# EAGLE schematic humanoid-11 (EAGLE 7.2.0)

## Sheet 1 of 10
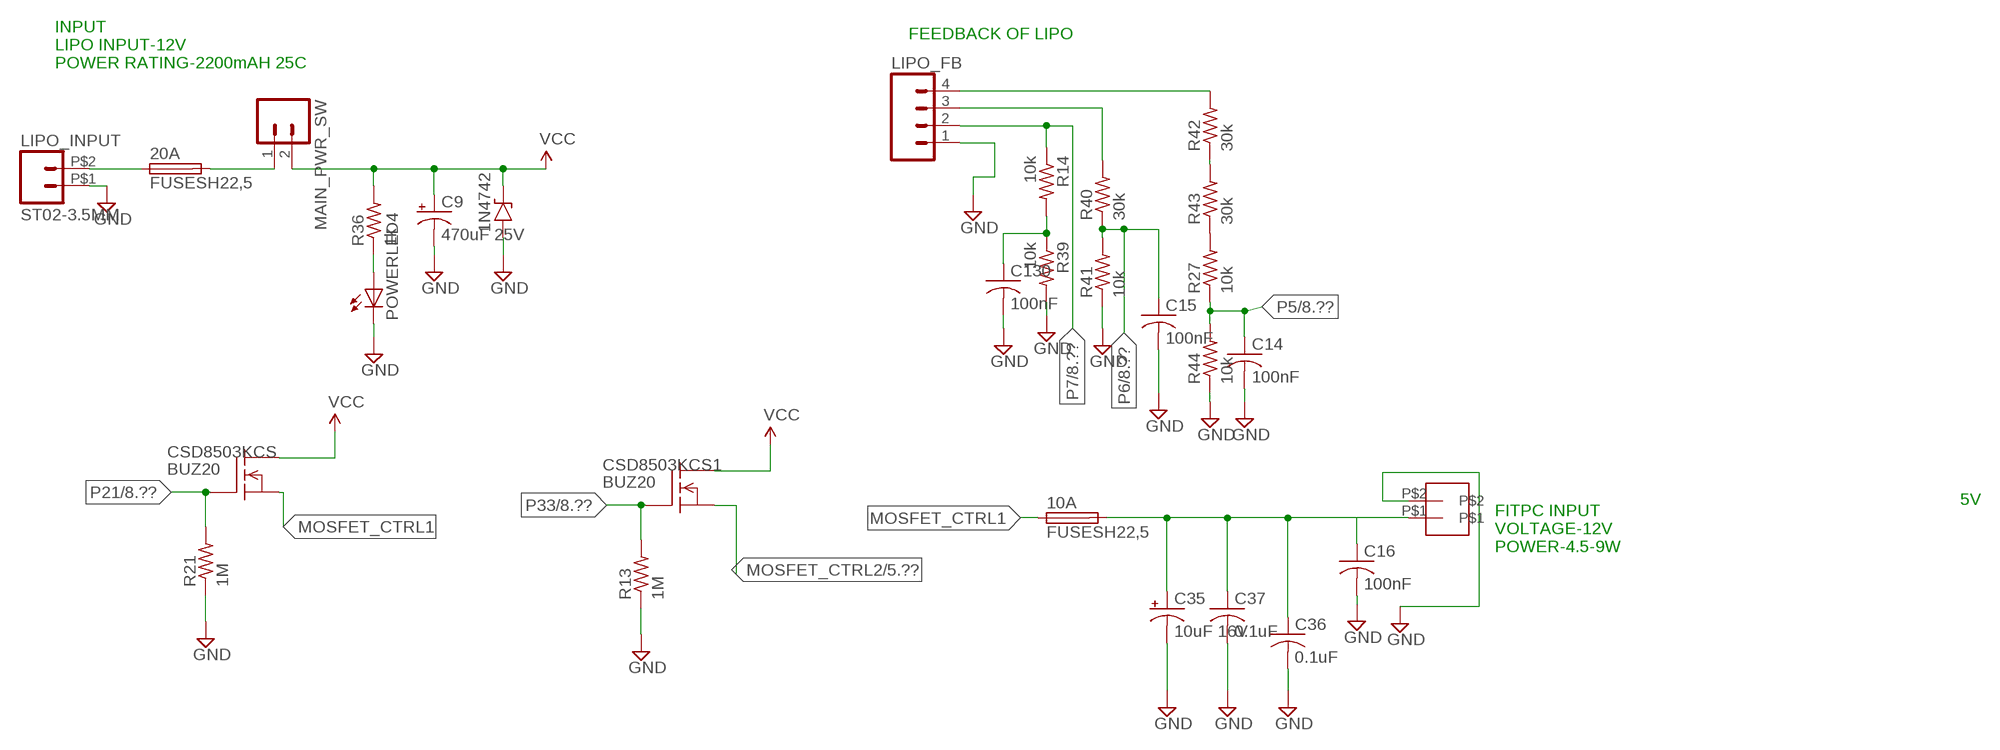
[diagram p0: schematic, sheet 1]

### Parts
1N4742  1N47XX3  [DO41-3]
10A  FUSESH22,5  [SH22,5]
20A  FUSESH22,5  [SH22,5]
C9  470uF 25V  CPOL-USG  [PANASONIC_G]
C14  100nF  C-USC1206  [C1206]
C15  100nF  C-USC1206  [C1206]
C16  100nF  C-USC1206  [C1206]
C35  10uF 16V  CPOL-USB  [PANASONIC_B]
C36  0.1uF  C-USC0805  [C0805]
C37  0.1uF  C-USC0805  [C0805]
C130  100nF  C-USC1206  [C1206]
CSD8503KCS  BUZ20  [TO220]
CSD8503KCS1  BUZ20  [TO220]
FITPC  2PINRIGHT  [2PINRIGHT]
LIPO_FB  M04PTH  [1X04]
LIPO_INPUT  ST02-3.5MM  [ED350V-02P]
MAIN_PWR_SW  M02PTH  [1X02]
POWERLED4  LEDCHIPLED_1206  [CHIPLED_1206]
R13  1M  R-US_R0805  [R0805]
R14  10k  R-US_R0805  [R0805]
R21  1M  R-US_R0805  [R0805]
R27  10k  R-US_R0805  [R0805]
R36  1k  R-US_R0805  [R0805]
R39  10k  R-US_R0805  [R0805]
R40  30k  R-US_R0805  [R0805]
R41  10k  R-US_R0805  [R0805]
R42  30k  R-US_R0805  [R0805]
R43  30k  R-US_R0805  [R0805]
R44  10k  R-US_R0805  [R0805]

### Nets
GND: 1N4742.A C9.- C14.2 C15.2 C16.2 C35.- C36.2 C37.2 C130.2 FITPC.P$2 LIPO_FB.1 LIPO_INPUT.P$1 POWERLED4.C R13.1 R21.1 R39.2 R41.1 R44.1 ; also sheet 2,3,5,6,7,8,9,10
LIPO_FB4: LIPO_FB.4 R42.2
MOSFET_CTRL1: 10A.1 CSD8503KCS.3(S)
MOSFET_CTRL2: CSD8503KCS1.3(S) ; also sheet 5
N$1: C130.1 R14.2 R39.1
N$9: 20A.2 MAIN_PWR_SW.1
N$14: 20A.1 LIPO_INPUT.P$2
N$19: R27.2 R43.1
N$337: R42.1 R43.2
N$338: LIPO_FB.3 R40.2
N$378: 10A.2 C16.1 C35.+ C36.1 C37.1 FITPC.P$1
N$381: POWERLED4.A R36.1
P5: C14.1 R27.1 R44.2 ; also sheet 8
P6: C15.1 R40.1 R41.2 ; also sheet 8
P7: LIPO_FB.2 R14.1 ; also sheet 8
P21: CSD8503KCS.1(G) R21.2 ; also sheet 8
P33: CSD8503KCS1.1(G) R13.2 ; also sheet 8
VCC: 1N4742.C C9.+ CSD8503KCS1.2(D) CSD8503KCS.2(D) MAIN_PWR_SW.2 R36.2 ; also sheet 3

### Notes on the sheet
- FEEDBACK OF LIPO
- INPUT
  LIPO INPUT-12V
  POWER RATING-2200mAH 25C
- 5V
- FITPC INPUT
  VOLTAGE-12V
  POWER-4.5-9W

## Sheet 2 of 10
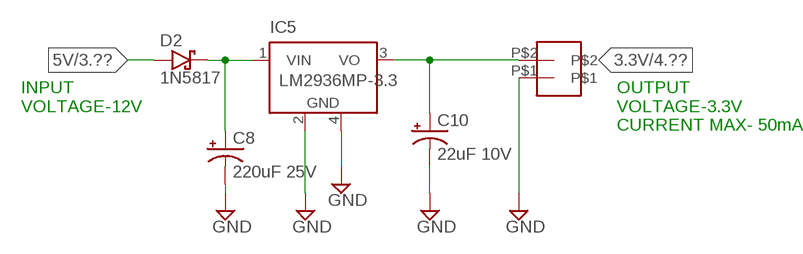
[diagram p1: schematic, sheet 2]

### Parts
3.3V1  2PINRIGHT  [2PINRIGHT]
C8  220uF 25V  CPOL-USG  [PANASONIC_G]
C10  22uF 10V  CPOL-USB  [PANASONIC_B]
D2  1N5817  [DO41-3]
IC5  LM2936MP-3.3  [SOT223]

### Nets
3.3V: 3.3V1.P$2 C10.+ IC5.3(VO) ; also sheet 4,8,9,10
5V: D2.A ; also sheet 3,4,6,7,8,9
GND: 3.3V1.P$1 C8.- C10.- IC5.2(GND) IC5.4(GND) ; also sheet 1,3,5,6,7,8,9,10
N$3: C8.+ D2.C IC5.1(VIN)

### Notes on the sheet
- INPUT
  VOLTAGE-12V
- OUTPUT
  VOLTAGE-3.3V
  CURRENT MAX- 50mA

## Sheet 3 of 10
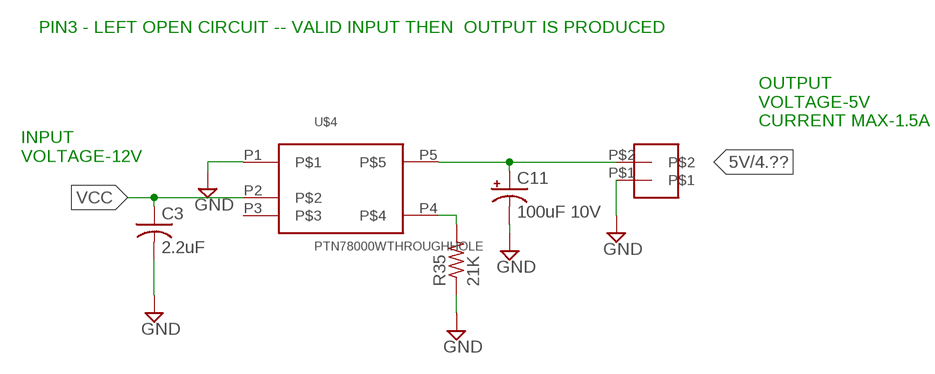
[diagram p2: schematic, sheet 3]

### Parts
5V1  2PINRIGHT  [2PINRIGHT]
C3  2.2uF  C-USC1608  [C1608]
C11  100uF 10V  CPOL-USE  [PANASONIC_E]
R35  21K  R-US_R0805  [R0805]
U$4  PTN78000WTHROUGHHOLE  [PTN78000W]

### Nets
5V: 5V1.P$2 C11.+ U$4.P5 ; also sheet 2,4,6,7,8,9
GND: 5V1.P$1 C3.2 C11.- R35.1 U$4.P1 ; also sheet 1,2,5,6,7,8,9,10
N$76: R35.2 U$4.P4
VCC: C3.1 U$4.P2 ; also sheet 1
Unconnected: U$4.P3

### Notes on the sheet
- PIN3 - LEFT OPEN CIRCUIT -- VALID INPUT THEN  OUTPUT IS PRODUCED
- OUTPUT
  VOLTAGE-5V
  CURRENT MAX-1.5A
- INPUT
  VOLTAGE-12V

## Sheet 4 of 10
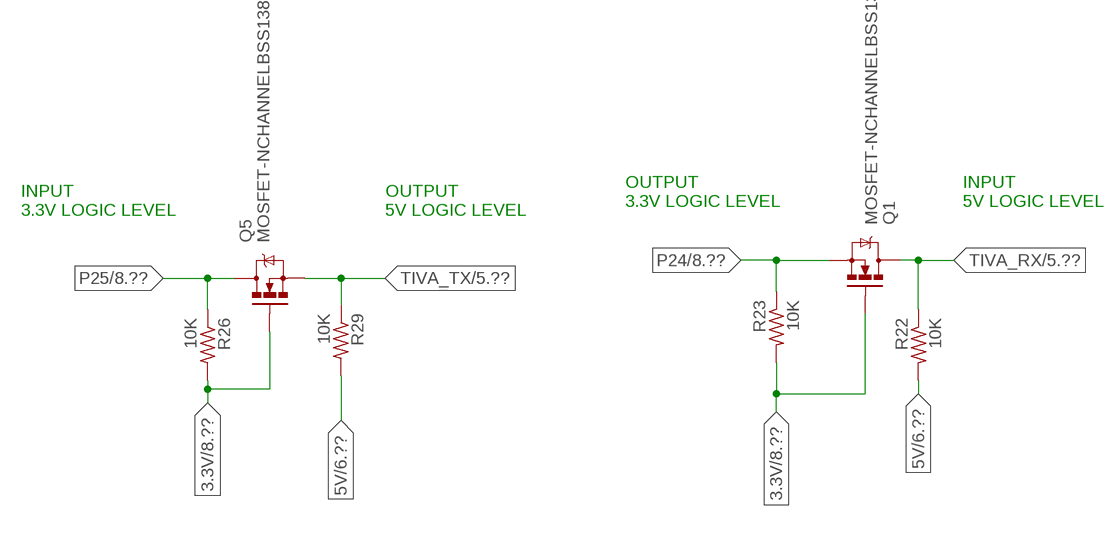
[diagram p3: schematic, sheet 4]

### Parts
Q1  MOSFET-NCHANNELBSS138  [SOT23]
Q5  MOSFET-NCHANNELBSS138  [SOT23]
R22  10K  R-US_R0805  [R0805]
R23  10K  R-US_R0805  [R0805]
R26  10K  R-US_R0805  [R0805]
R29  10K  R-US_R0805  [R0805]

### Nets
3.3V: Q1.1(G) Q5.1(G) R23.2 R26.2 ; also sheet 2,8,9,10
5V: R22.2 R29.2 ; also sheet 2,3,6,7,8,9
P24: Q1.2(S) R23.1 ; also sheet 8
P25: Q5.3(D) R26.1 ; also sheet 8
TIVA_RX: Q1.3(D) R22.1 ; also sheet 5
TIVA_TX: Q5.2(S) R29.1 ; also sheet 5

### Notes on the sheet
- OUTPUT
  3.3V LOGIC LEVEL
- INPUT
  5V LOGIC LEVEL
- INPUT
  3.3V LOGIC LEVEL
- OUTPUT
  5V LOGIC LEVEL

## Sheet 5 of 10
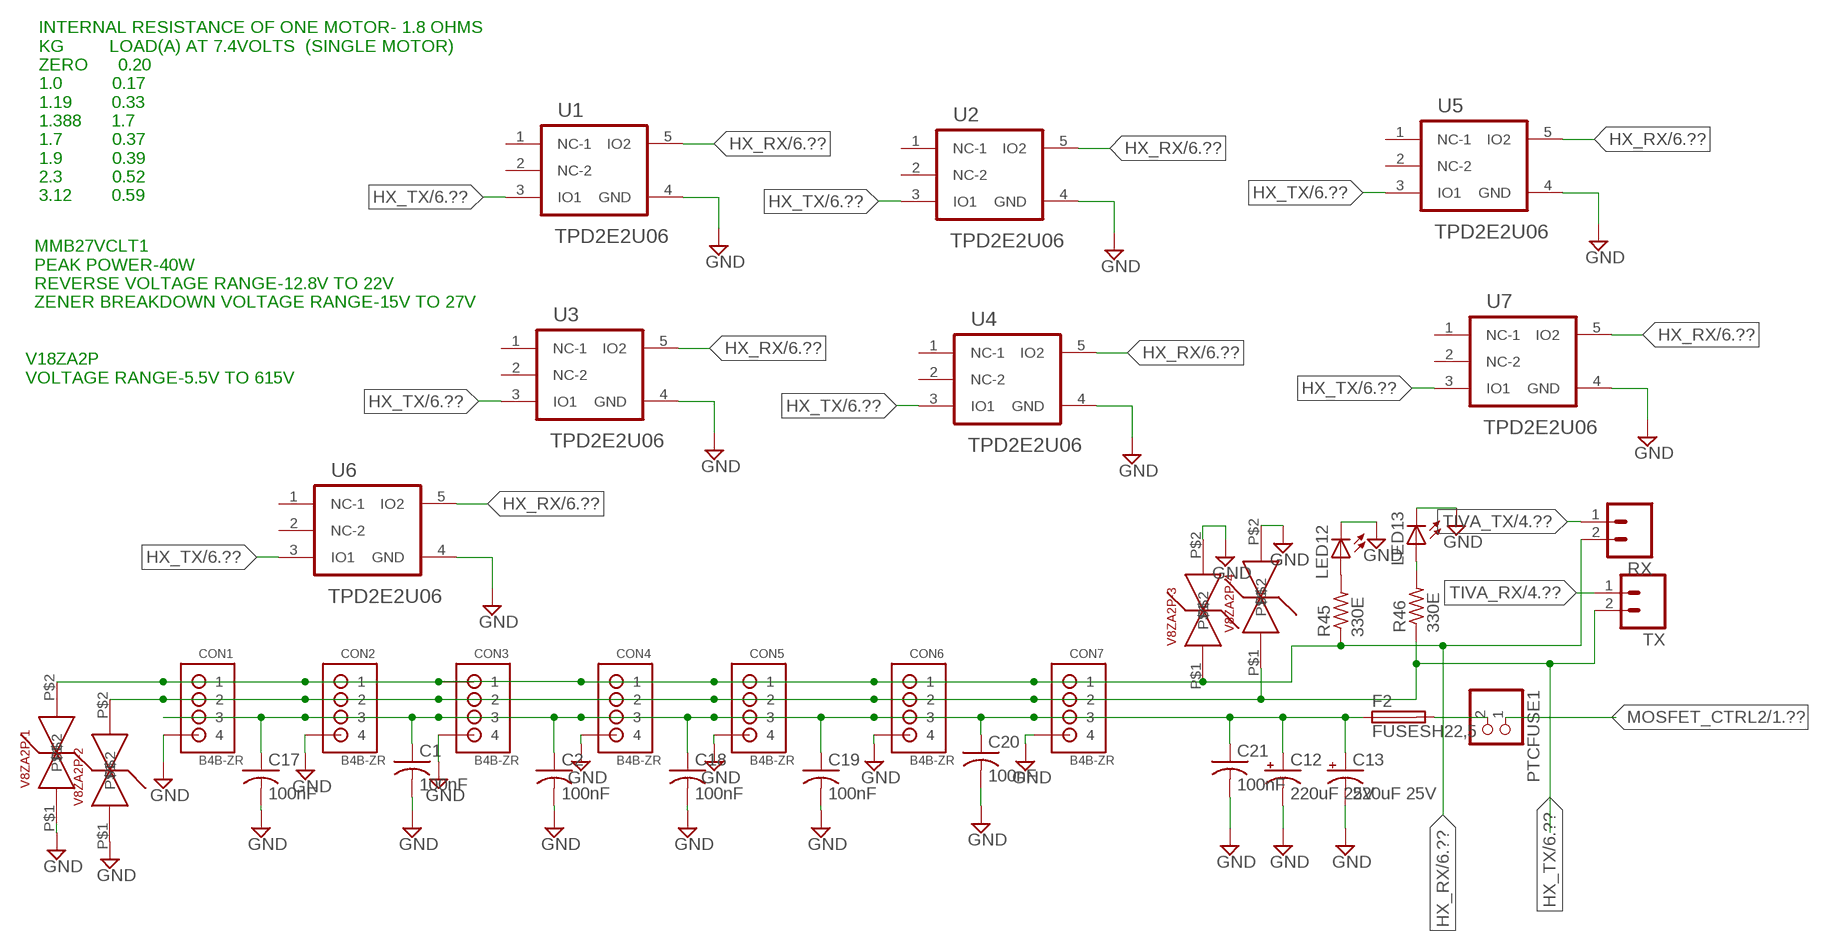
[diagram p4: schematic, sheet 5]

### Parts
C1  100nF  C-USC1206  [C1206]
C2  100nF  C-USC1206  [C1206]
C12  220uF 25V  CPOL-USG  [PANASONIC_G]
C13  220uF 25V  CPOL-USG  [PANASONIC_G]
C17  100nF  C-USC1206  [C1206]
C18  100nF  C-USC1206  [C1206]
C19  100nF  C-USC1206  [C1206]
C20  100nF  C-USC1206  [C1206]
C21  100nF  C-USC1206  [C1206]
CON1  B4B-ZR  [B4B-ZR]
CON2  B4B-ZR  [B4B-ZR]
CON3  B4B-ZR  [B4B-ZR]
CON4  B4B-ZR  [B4B-ZR]
CON5  B4B-ZR  [B4B-ZR]
CON6  B4B-ZR  [B4B-ZR]
CON7  B4B-ZR  [B4B-ZR]
F2  FUSESH22,5  [SH22,5]
LED12  LEDCHIPLED_1206  [CHIPLED_1206]
LED13  LEDCHIPLED_1206  [CHIPLED_1206]
PTCFUSE1  PINHD-1X2  [1X02]
R45  330E  R-US_R0805  [R0805]
R46  330E  R-US_R0805  [R0805]
RX  M02PTH  [1X02]
TX  M02PTH  [1X02]
U1  TPD2E2U06  [SOT50P160X60-5N]
U2  TPD2E2U06  [SOT50P160X60-5N]
U3  TPD2E2U06  [SOT50P160X60-5N]
U4  TPD2E2U06  [SOT50P160X60-5N]
U5  TPD2E2U06  [SOT50P160X60-5N]
U6  TPD2E2U06  [SOT50P160X60-5N]
U7  TPD2E2U06  [SOT50P160X60-5N]
V8ZA2P-1  V18ZA2P  [V18ZA2P]
V8ZA2P-2  V18ZA2P  [V18ZA2P]
V8ZA2P-3  V18ZA2P  [V18ZA2P]
V8ZA2P-4  V18ZA2P  [V18ZA2P]

### Nets
GND: C1.2 C2.2 C12.- C13.- C17.2 C18.2 C19.2 C20.2 C21.2 CON1.4 CON2.4 CON3.4 CON4.4 CON5.4 CON6.4 CON7.4 LED12.C LED13.C U1.4(GND) U2.4(GND) U3.4(GND) U4.4(GND) U5.4(GND) U6.4(GND) U7.4(GND) V8ZA2P-1.P$1 V8ZA2P-2.P$1 V8ZA2P-3.P$2 V8ZA2P-4.P$2 ; also sheet 1,2,3,6,7,8,9,10
HX_RX: CON1.1 CON2.1 CON3.1 CON4.1 CON5.1 CON6.1 CON7.1 R45.1 RX.2 U1.5(IO2) U2.5(IO2) U3.5(IO2) U4.5(IO2) U5.5(IO2) U6.5(IO2) U7.5(IO2) V8ZA2P-1.P$2 V8ZA2P-3.P$1 ; also sheet 6
HX_TX: CON1.2 CON2.2 CON3.2 CON4.2 CON5.2 CON6.2 CON7.2 R46.1 TX.2 U1.3(IO1) U2.3(IO1) U3.3(IO1) U4.3(IO1) U5.3(IO1) U6.3(IO1) U7.3(IO1) V8ZA2P-2.P$2 V8ZA2P-4.P$1 ; also sheet 6
MOSFET_CTRL2: PTCFUSE1.1 ; also sheet 1
N$2: C1.1 C2.1 C12.+ C13.+ C17.1 C18.1 C19.1 C20.1 C21.1 CON1.3 CON2.3 CON3.3 CON4.3 CON5.3 CON6.3 CON7.3 F2.1
N$70: F2.2 PTCFUSE1.2
N$73: LED12.A R45.2
N$74: LED13.A R46.2
TIVA_RX: TX.1 ; also sheet 4
TIVA_TX: RX.1 ; also sheet 4
Unconnected: U1.1(NC-1) U1.2(NC-2) U2.1(NC-1) U2.2(NC-2) U3.1(NC-1) U3.2(NC-2) U4.1(NC-1) U4.2(NC-2) U5.1(NC-1) U5.2(NC-2) U6.1(NC-1) U6.2(NC-2) U7.1(NC-1) U7.2(NC-2)

### Notes on the sheet
- INTERNAL RESISTANCE OF ONE MOTOR- 1.8 OHMS
  KG         LOAD(A) AT 7.4VOLTS  (SINGLE MOTOR)
  ZERO      0.20
  1.0          0.17
  1.19        0.33
  1.388      1.7
  1.7          0.37
  1.9          0.39
  2.3          0.52
  3.12        0.59
- MMB27VCLT1
  PEAK POWER-40W
  REVERSE VOLTAGE RANGE-12.8V TO 22V
  ZENER BREAKDOWN VOLTAGE RANGE-15V TO 27V
- V18ZA2P
  VOLTAGE RANGE-5.5V TO 615V

## Sheet 6 of 10
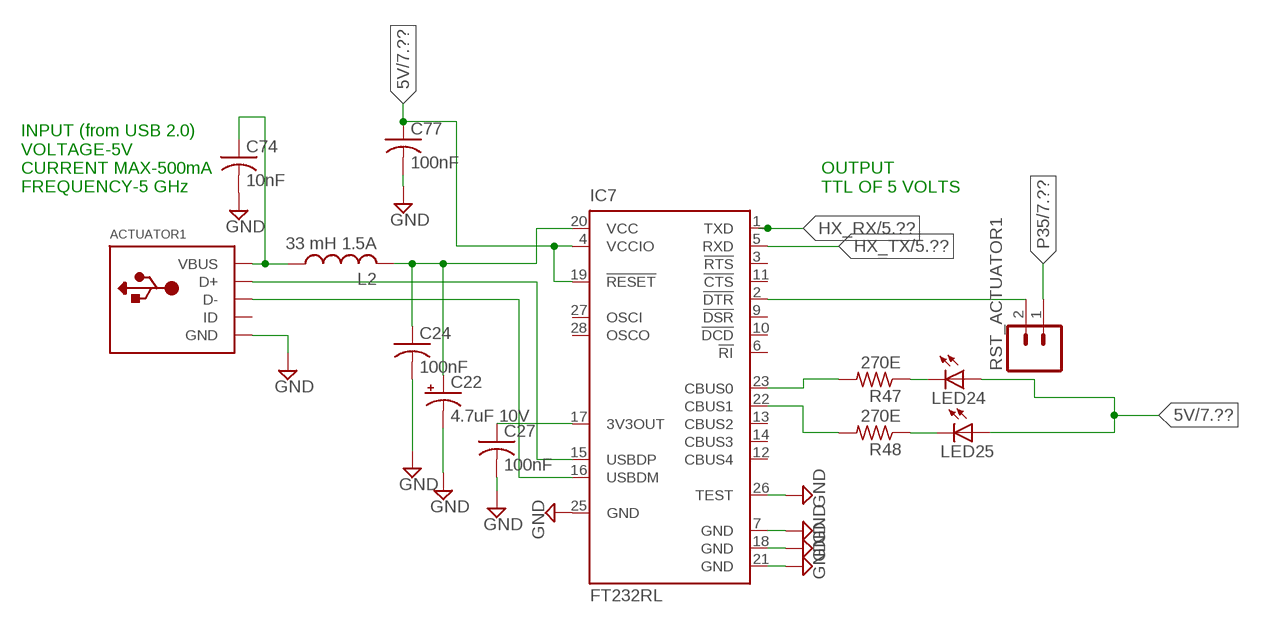
[diagram p5: schematic, sheet 6]

### Parts
ACTUATOR1  USBMINIB  [USB-MINIB]
C22  4.7uF 10V  CPOL-USB  [PANASONIC_B]
C24  100nF  C-USC1206  [C1206]
C27  100nF  C-USC1206  [C1206]
C74  10nF  C-USC1206  [C1206]
C77  100nF  C-USC1206  [C1206]
IC7  FT232RL  [SSOP28]
L2  33 mH 1.5A  L-USL0805  [L0805]
LED24  LEDCHIPLED_1206  [CHIPLED_1206]
LED25  LEDCHIPLED_1206  [CHIPLED_1206]
R47  270E  R-US_R0805  [R0805]
R48  270E  R-US_R0805  [R0805]
RST_ACTUATOR1  M02PTH  [1X02]

### Nets
5V: C77.1 IC7.4(VCCIO) IC7.19(!RESET) LED24.A LED25.A ; also sheet 2,3,4,7,8,9
GND: ACTUATOR1.GND C22.- C24.2 C27.2 C74.2 C77.2 IC7.7(GND) IC7.18(GND) IC7.21(GND) IC7.25(GND) IC7.26(TEST) ; also sheet 1,2,3,5,7,8,9,10
HX_RX: IC7.1(TXD) ; also sheet 5
HX_TX: IC7.5(RXD) ; also sheet 5
N$4: IC7.22(CBUS1) R48.2
N$5: IC7.23(CBUS0) R47.2
N$6: LED24.C R47.1
N$8: LED25.C R48.1
N$92: ACTUATOR1.VBUS C74.1 L2.1
N$93: C22.+ C24.1 IC7.20(VCC) L2.2
N$94: ACTUATOR1.D+ IC7.15(USBDP)
N$95: ACTUATOR1.D- IC7.16(USBDM)
N$115: C27.1 IC7.17(3V3OUT)
N$116: IC7.2(!DTR) RST_ACTUATOR1.2
P35: RST_ACTUATOR1.1 ; also sheet 7,8
Unconnected: ACTUATOR1.ID IC7.3(!RTS) IC7.6(!RI) IC7.9(!DSR) IC7.10(!DCD) IC7.11(!CTS) IC7.12(CBUS4) IC7.13(CBUS2) IC7.14(CBUS3) IC7.27(OSCI) IC7.28(OSCO)

### Notes on the sheet
- INPUT (from USB 2.0)
  VOLTAGE-5V
  CURRENT MAX-500mA
  FREQUENCY-5 GHz
- OUTPUT
  TTL OF 5 VOLTS

## Sheet 7 of 10
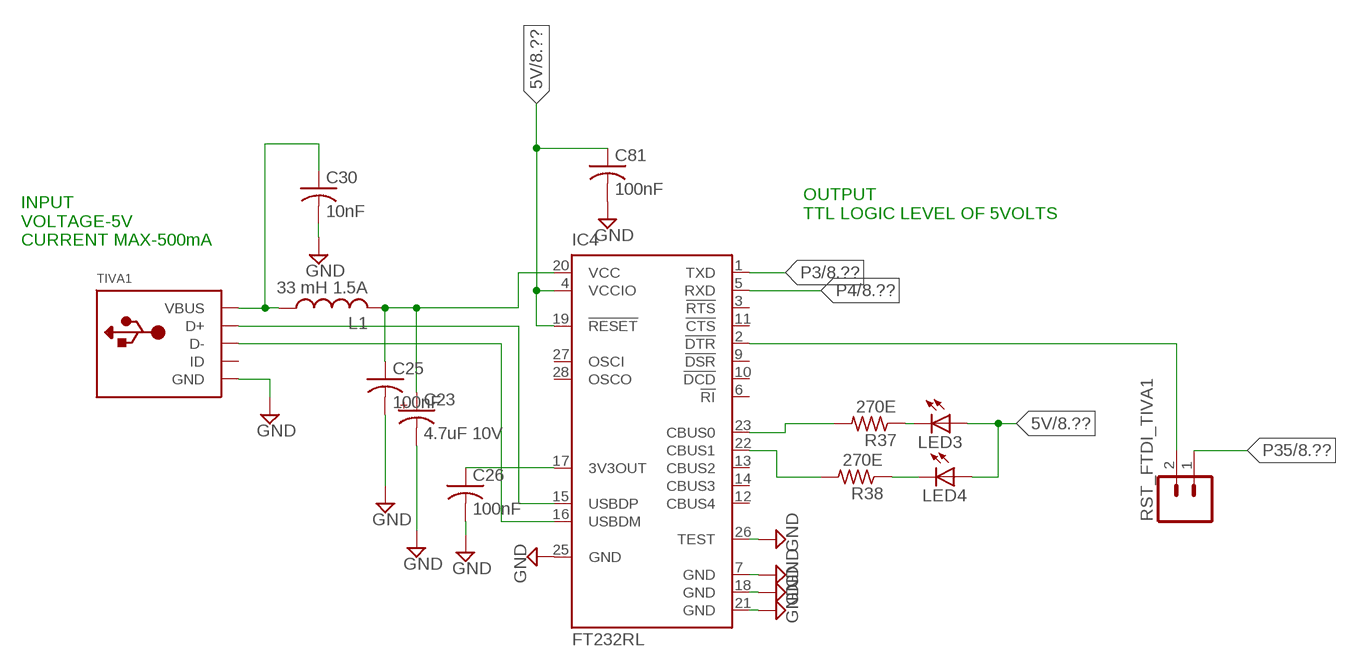
[diagram p6: schematic, sheet 7]

### Parts
C23  4.7uF 10V  CPOL-USB  [PANASONIC_B]
C25  100nF  C-USC1206  [C1206]
C26  100nF  C-USC1206  [C1206]
C30  10nF  C-USC1206  [C1206]
C81  100nF  C-USC1206  [C1206]
IC4  FT232RL  [SSOP28]
L1  33 mH 1.5A  L-USL0805  [L0805]
LED3  LEDCHIPLED_1206  [CHIPLED_1206]
LED4  LEDCHIPLED_1206  [CHIPLED_1206]
R37  270E  R-US_R0805  [R0805]
R38  270E  R-US_R0805  [R0805]
RST_FTDI_TIVA1  M02PTH  [1X02]
TIVA1  USBMINIB  [USB-MINIB]

### Nets
5V: C81.1 IC4.4(VCCIO) IC4.19(!RESET) LED3.A LED4.A ; also sheet 2,3,4,6,8,9
GND: C23.- C25.2 C26.2 C30.2 C81.2 IC4.7(GND) IC4.18(GND) IC4.21(GND) IC4.25(GND) IC4.26(TEST) TIVA1.GND ; also sheet 1,2,3,5,6,8,9,10
N$7: C30.1 L1.1 TIVA1.VBUS
N$10: C23.+ C25.1 IC4.20(VCC) L1.2
N$11: IC4.15(USBDP) TIVA1.D+
N$12: IC4.16(USBDM) TIVA1.D-
N$13: LED3.C R37.1
N$15: LED4.C R38.1
N$16: IC4.23(CBUS0) R37.2
N$17: IC4.22(CBUS1) R38.2
N$34: C26.1 IC4.17(3V3OUT)
N$35: IC4.2(!DTR) RST_FTDI_TIVA1.2
P3: IC4.1(TXD) ; also sheet 8
P4: IC4.5(RXD) ; also sheet 8
P35: RST_FTDI_TIVA1.1 ; also sheet 6,8
Unconnected: IC4.3(!RTS) IC4.6(!RI) IC4.9(!DSR) IC4.10(!DCD) IC4.11(!CTS) IC4.12(CBUS4) IC4.13(CBUS2) IC4.14(CBUS3) IC4.27(OSCI) IC4.28(OSCO) TIVA1.ID

### Notes on the sheet
- OUTPUT
  TTL LOGIC LEVEL OF 5VOLTS
- INPUT
  VOLTAGE-5V
  CURRENT MAX-500mA

## Sheet 8 of 10
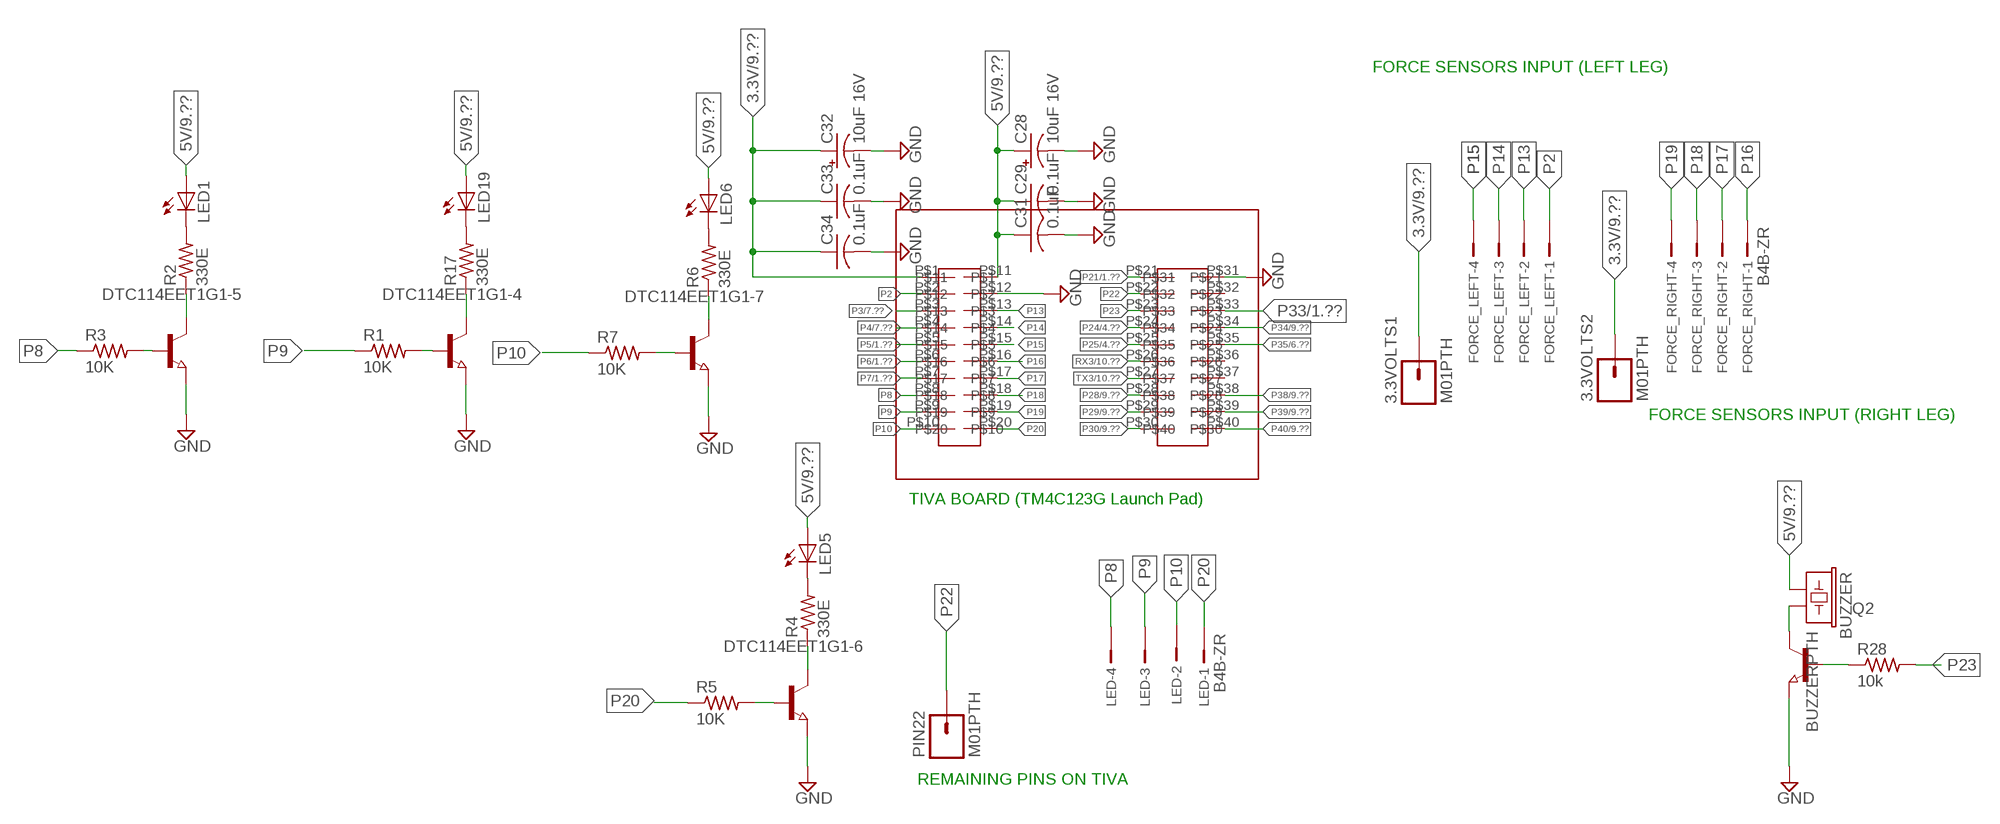
[diagram p7: schematic, sheet 8]

### Parts
3.3VOLTS1  M01PTH  [1X01]
3.3VOLTS2  M01PTH  [1X01]
BUZZER  BUZZERPTH  [BUZZER-12MM]
C28  10uF 16V  CPOL-USB  [PANASONIC_B]
C29  0.1uF  C-USC0805  [C0805]
C31  0.1uF  C-USC0805  [C0805]
C32  10uF 16V  CPOL-USB  [PANASONIC_B]
C33  0.1uF  C-USC0805  [C0805]
C34  0.1uF  C-USC0805  [C0805]
DTC114EET1G1-4  NPN-TRANSISTOR_SOT23  [SOT23]
DTC114EET1G1-5  NPN-TRANSISTOR_SOT23  [SOT23]
DTC114EET1G1-6  NPN-TRANSISTOR_SOT23  [SOT23]
DTC114EET1G1-7  NPN-TRANSISTOR_SOT23  [SOT23]
FORCE_LEFT  B4B-ZR  [B4B-ZR]
FORCE_RIGHT  B4B-ZR  [B4B-ZR]
LED  B4B-ZR  [B4B-ZR]
LED1  LEDCHIPLED_1206  [CHIPLED_1206]
LED5  LEDCHIPLED_1206  [CHIPLED_1206]
LED6  LEDCHIPLED_1206  [CHIPLED_1206]
LED19  LEDCHIPLED_1206  [CHIPLED_1206]
PIN22  M01PTH  [1X01]
Q2  NPN-TRANSISTOR_SOT23  [SOT23]
R1  10K  R-US_R0805  [R0805]
R2  330E  R-US_R0805  [R0805]
R3  10K  R-US_R0805  [R0805]
R4  330E  R-US_R0805  [R0805]
R5  10K  R-US_R0805  [R0805]
R6  330E  R-US_R0805  [R0805]
R7  10K  R-US_R0805  [R0805]
R17  330E  R-US_R0805  [R0805]
R28  10k  R-US_R0805  [R0805]
U$1  TIVA  [TIVA]

### Nets
3.3V: 3.3VOLTS1.1 3.3VOLTS2.1 C32.+ C33.1 C34.1 U$1.P$1 ; also sheet 2,4,9,10
5V: BUZZER.+ C28.+ C29.1 C31.1 LED1.A LED5.A LED6.A LED19.A U$1.P$11 ; also sheet 2,3,4,6,7,9
GND: C28.- C29.2 C31.2 C32.- C33.2 C34.2 DTC114EET1G1-4.2(E) DTC114EET1G1-5.2(E) DTC114EET1G1-6.2(E) DTC114EET1G1-7.2(E) Q2.2(E) U$1.P$12 U$1.P$31 ; also sheet 1,2,3,5,6,7,9,10
N$20: BUZZER.- Q2.3(C)
N$21: Q2.1(B) R28.1
N$22: DTC114EET1G1-4.1(B) R1.2
N$24: LED19.C R17.2
N$25: DTC114EET1G1-4.3(C) R17.1
N$26: DTC114EET1G1-5.1(B) R3.2
N$32: LED1.C R2.2
N$33: DTC114EET1G1-5.3(C) R2.1
N$36: DTC114EET1G1-6.1(B) R5.2
N$40: LED5.C R4.2
N$41: DTC114EET1G1-6.3(C) R4.1
N$42: DTC114EET1G1-7.1(B) R7.2
N$43: LED6.C R6.2
N$44: DTC114EET1G1-7.3(C) R6.1
P2: FORCE_LEFT.1 U$1.P$2
P3: U$1.P$3 ; also sheet 7
P4: U$1.P$4 ; also sheet 7
P5: U$1.P$5 ; also sheet 1
P6: U$1.P$6 ; also sheet 1
P7: U$1.P$7 ; also sheet 1
P8: LED.4 R3.1 U$1.P$8
P9: LED.3 R1.1 U$1.P$9
P10: LED.2 R7.1 U$1.P$10
P13: FORCE_LEFT.2 U$1.P$13
P14: FORCE_LEFT.3 U$1.P$14
P15: FORCE_LEFT.4 U$1.P$15
P16: FORCE_RIGHT.1 U$1.P$16
P17: FORCE_RIGHT.2 U$1.P$17
P18: FORCE_RIGHT.3 U$1.P$18
P19: FORCE_RIGHT.4 U$1.P$19
P20: LED.1 R5.1 U$1.P$20
P21: U$1.P$21 ; also sheet 1
P22: PIN22.1 U$1.P$22
P23: R28.2 U$1.P$23
P24: U$1.P$24 ; also sheet 4
P25: U$1.P$25 ; also sheet 4
P28: U$1.P$28 ; also sheet 9
P29: U$1.P$29 ; also sheet 9
P30: U$1.P$30 ; also sheet 9
P33: U$1.P$33 ; also sheet 1
P34: U$1.P$34 ; also sheet 9
P35: U$1.P$35 ; also sheet 6,7
P38: U$1.P$38 ; also sheet 9
P39: U$1.P$39 ; also sheet 9
P40: U$1.P$40 ; also sheet 9
RX3: U$1.P$26 ; also sheet 10
TX3: U$1.P$27 ; also sheet 10
Unconnected: U$1.P$32 U$1.P$36 U$1.P$37

### Notes on the sheet
- FORCE SENSORS INPUT (LEFT LEG)
- FORCE SENSORS INPUT (RIGHT LEG)
- TIVA BOARD (TM4C123G Launch Pad)
- REMAINING PINS ON TIVA

## Sheet 9 of 10
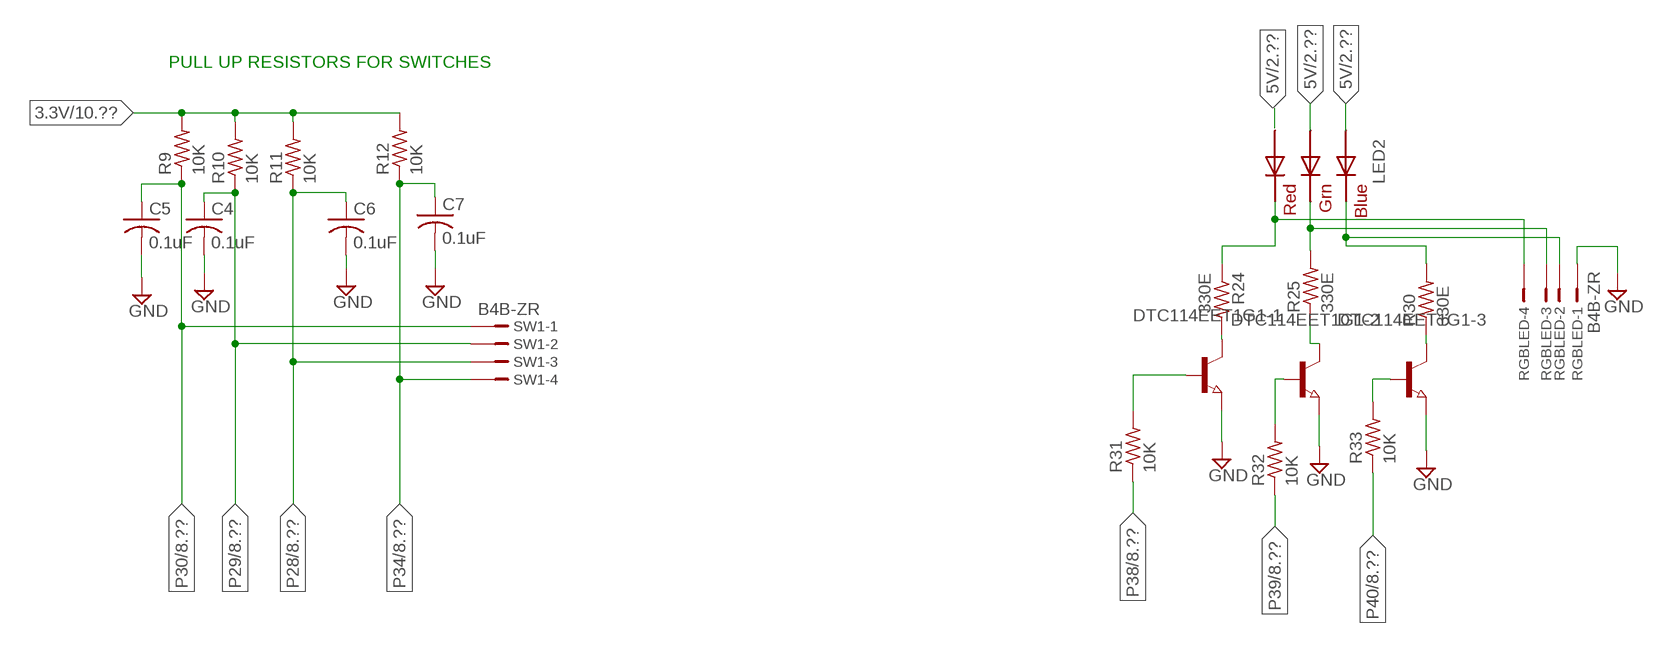
[diagram p8: schematic, sheet 9]

### Parts
C4  0.1uF  C-USC1206  [C1206]
C5  0.1uF  C-USC1206  [C1206]
C6  0.1uF  C-USC1206  [C1206]
C7  0.1uF  C-USC1206  [C1206]
DTC114EET1G1-1  NPN-TRANSISTOR_SOT23  [SOT23]
DTC114EET1G1-2  NPN-TRANSISTOR_SOT23  [SOT23]
DTC114EET1G1-3  NPN-TRANSISTOR_SOT23  [SOT23]
LED2  RGBLED5050  [RGBLED5050]
R9  10K  R-US_R0805  [R0805]
R10  10K  R-US_R0805  [R0805]
R11  10K  R-US_R0805  [R0805]
R12  10K  R-US_R0805  [R0805]
R24  330E  R-US_R0805  [R0805]
R25  330E  R-US_R0805  [R0805]
R30  330E  R-US_R0805  [R0805]
R31  10K  R-US_R0805  [R0805]
R32  10K  R-US_R0805  [R0805]
R33  10K  R-US_R0805  [R0805]
RGBLED  B4B-ZR  [B4B-ZR]
SW1  B4B-ZR  [B4B-ZR]

### Nets
3.3V: R9.2 R10.2 R11.2 R12.2 ; also sheet 2,4,8,10
5V: LED2.1(GREEN_A) LED2.3(BLUE_A) ; also sheet 2,3,4,6,7,8
GND: C4.2 C5.2 C6.2 C7.2 DTC114EET1G1-1.2(E) DTC114EET1G1-2.2(E) DTC114EET1G1-3.2(E) RGBLED.1 ; also sheet 1,2,3,5,6,7,8,10
N$18: LED2.5(RED_C) R24.1 RGBLED.4
N$27: LED2.6(GREEN_C) R25.2 RGBLED.3
N$28: LED2.4(BLUE_C) R30.2 RGBLED.2
N$29: DTC114EET1G1-1.3(C) R24.2
N$30: DTC114EET1G1-2.3(C) R25.1
N$31: DTC114EET1G1-3.3(C) R30.1
N$37: DTC114EET1G1-1.1(B) R31.2
N$38: DTC114EET1G1-2.1(B) R32.2
N$39: DTC114EET1G1-3.1(B) R33.2
P28: C6.1 R11.1 SW1.3 ; also sheet 8
P29: C4.1 R10.1 SW1.2 ; also sheet 8
P30: C5.1 R9.1 SW1.1 ; also sheet 8
P34: C7.1 R12.1 SW1.4 ; also sheet 8
P38: R31.1 ; also sheet 8
P39: R32.1 ; also sheet 8
P40: R33.1 ; also sheet 8
Unconnected: LED2.2(RED_A)

### Notes on the sheet
- PULL UP RESISTORS FOR SWITCHES

## Sheet 10 of 10
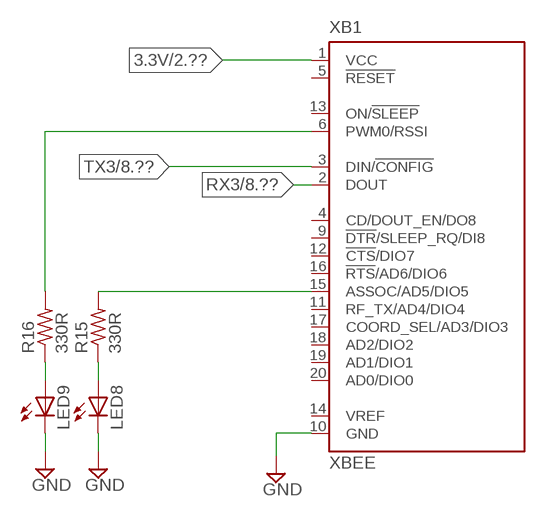
[diagram p9: schematic, sheet 10]

### Parts
LED8  LEDCHIPLED_1206  [CHIPLED_1206]
LED9  LEDCHIPLED_1206  [CHIPLED_1206]
R15  330R  R-US_R0805  [R0805]
R16  330R  R-US_R0805  [R0805]
XB1  XBEE  [XBEE]

### Nets
3.3V: XB1.1(VCC) ; also sheet 2,4,8,9
GND: LED8.C LED9.C XB1.10(GND) ; also sheet 1,2,3,5,6,7,8,9
N$53: LED8.A R15.1
N$54: LED9.A R16.1
N$55: R15.2 XB1.15(ASSOC/AD5/DIO5)
N$56: R16.2 XB1.6(PWM0/RSSI)
RX3: XB1.2(DOUT) ; also sheet 8
TX3: XB1.3(DIN/!CONFIG) ; also sheet 8
Unconnected: XB1.4(CD/DOUT_EN/DO8) XB1.5(!RESET) XB1.9(!DTR!/SLEEP_RQ/DI8) XB1.11(RF_TX/AD4/DIO4) XB1.12(!CTS!/DIO7) XB1.13(ON/!SLEEP) XB1.14(VREF) XB1.16(!RTS!/AD6/DIO6) XB1.17(COORD_SEL/AD3/DIO3) XB1.18(AD2/DIO2) XB1.19(AD1/DIO1) XB1.20(AD0/DIO0)

## Library data of the parts
1N4742 = gm-diodes:1N47XX: Zener Diode 1N4728 - 1N4764: 3.3 V - 100V, 10% (1n47xxA 5%); DO-41 glass case; OC_NEWARK: unknown
3.3V1 5V1 FITPC = jst 2.5mm:2PINRIGHT; OC_NEWARK: unknown
3.3VOLTS1 3.3VOLTS2 PIN22 = SparkFun-Connectors:M01: Header 1 Standard 1-pin 0.1" header. Use with straight break away headers (SKU : PRT-00116), right angle break away headers (PRT-00553), swiss pins (PRT-00743), machine pins (PRT-00117), and female headers (PRT-00115).
10A 20A F2 = fuse:FUSE: Fuse; OC_FARNELL: unknown; OC_NEWARK: unknown
ACTUATOR1 TIVA1 = adafruit:USB: USB Connectors USBMINIB - Surface Mount Female Mini-B USB Connector 4UConnector: 06564 By microbuilder.eu Thru-hole RA Female Mini-B USB Connector 4UConnector: 18732 By ladyada.net; OC_NEWARK: unknown
BUZZER = SparkFun-Electromechanical:BUZZER: Buzzer 12mm Spark Fun Electronics SKU : Comp-Buzzer
C1 C2 C14-C21 C24-C27 C130 = adafruit:C-US: CAPACITOR, American symbol; MANUFACTURER: KEMET; OC_NEWARK: unknown; PARTNO: C1206C104K5RACTU
C3 = resistor:C-US: CAPACITOR, American symbol; MANUFACTURER: TDK; MOUSER_PARTNO: 810-C1608X7R1A225K; PARTNO: C1608X7R1A225K080AC; SELLER: MOUSER
C4-C7 = adafruit:C-US: CAPACITOR, American symbol; MANUFACTURER: Kemet; MOUSER_PARTNO: 80-C0805C104M5R; OC_NEWARK: unknown; PARTNO: C0805C104M5RACTU; SELLER: MOUSER
C8 C12 C13 = resistor:CPOL-US: POLARIZED CAPACITOR, American symbol; MANUFACTURER: PANASONIC ELECTRONIC COMPONENTS; MOUSER_PARTNO: 667-EEE-1EA221P; OC_NEWARK: unknown; PARTNO: EEE-1EA221P; SELLER: MOUSER ELECTRONICS
C9 = resistor:CPOL-US: POLARIZED CAPACITOR, American symbol; MANUFACTURER: PANASONIC ELECTRONIC COMPONENTS; OC_NEWARK: unknown; PARTNO: EEEFK1E471AP
C10 = resistor:CPOL-US: POLARIZED CAPACITOR, American symbol; MANUFACTURER: PANASONIC ELECTRONIC COMPONENTS; OC_NEWARK: unknown; PARTNO: EEEFK1A220AR
C11 = resistor:CPOL-US: POLARIZED CAPACITOR, American symbol; MANUFACTURER: Panasonic; MOUSER_PARTNO: 667-EEE-HA1A101P; OC_NEWARK: unknown; PARTNO: EEE-HA1A101P; SELLER: MOUSER ELECTRONICS
C22 C23 = resistor:CPOL-US: POLARIZED CAPACITOR, American symbol; MANUFACTURER: Panasonic; MOUSER_PARTNO: 667-10SVP4R7M; OC_NEWARK: unknown; PARTNO: 10SVP4R7M; SELLER: MOUSER
C28 C32 C35 = resistor:CPOL-US: POLARIZED CAPACITOR, American symbol
C29 C31 C33 C34 C36 C37 = resistor:C-US: CAPACITOR, American symbol
C30 C74 C77 C81 = adafruit:C-US: CAPACITOR, American symbol; OC_NEWARK: unknown
CON1-CON7 = jst_herkulex:B4B-ZR: JST-ZH Connector 4 pol, 1.5mm pitch Package: B4B-ZR Source: http://www.jst-mfg.com/product/pdf/eng/eZH.pdf; MF: FARNELL; MPN: B4B-ZR(LF)(SN); OC_NEWARK: unknown
CSD8503KCS CSD8503KCS1 = transistor-fet:BUZ20: N-Channel Enhancement MOSFET 100V; 12A; 0,2Ohm; OC_NEWARK: unknown
D2 = gm-diodes:1N5817; OC_NEWARK: unknown
DTC114EET1G1-1-DTC114EET1G1-7 = semicon-smd-ipc:NPN-TRANSISTOR_: NPN TRANSISTOR; OC_NEWARK: unknown
FORCE_LEFT FORCE_RIGHT LED RGBLED SW1 = con-jst:?4B-ZR: ZH CONNECTOR 1.5 mm, 4 pin 1 row Source: http://www.jst.com .. eZH.pdf; MF: FARNELL; MPN: B4B-ZR(LF)(SN); OC_FARNELL: 1830916; OC_NEWARK: unknown
IC4 IC7 = ftdichip:FT232R: Source: http://www.ftdichip.com/Documents/DataSheets/DS_FT232R_v104.pdf; MPN: FT232RL; OC_FARNELL: 1146032; OC_NEWARK: unknown
IC5 = national-semiconductor:LM2936MP?*: Ultra-Low Quiescent Current LDO Voltage Regulator Source: Data sheet <http://www.national.com/ds/LM/LM2936.pdf>; MF: NATIONAL SEMICONDUCTOR; MPN: LM2936MP-3.3/NOPB; OC_FARNELL: 1469062; OC_NEWARK: unknown
L1 L2 = rcl-2:L-US: INDUCTOR, American symbol; MANUFACTURER: Laird Technologies; MOUSER_PARTNO: 875-MI0805K400R-10; OC_NEWARK: unknown; PARTNO: MI0805K400R-10; SELLER: MOUSER ELECTRONICS
LED1 LED3-LED6 LED12 LED13 LED19 LED24 LED25 POWERLED4 = adafruit:LED: LED OSRAM: - CHIPLED LG R971, LG N971, LY N971, LG Q971, LY Q971, LO R971, LY R971 LH N974, LH R974 LS Q976, LO Q976, LY Q976 LO Q996 - Hyper CHIPLED LW Q18S LB Q993, LB Q99A, LB R99A - SideLED LS A670, LO A670, LY A670, LG A670, LP A670 LB A673, LV A673, LT A673, LW A673 LH A674 LY A675 LS A676, LA A676, LO A676, LY A676, LW A676 LS A679, LY A679, LG A679 - Hyper Micro SIDELED® LS Y876, LA Y876, LO Y876, LY Y876 LT Y87S - SmartLED LW L88C, LW L88S LB L89C, LB L89S, LG L890 LS L89K, LO L89K, LY L89K LS L896, LA L896, LO L896, LY L896 - TOPLED LS T670, LO T670, LY T670, LG T670, LP T670 LSG T670, LSP T670, LSY T670, LOP T670, LYG T670 LG T671, LOG T671, LSG T671 LB T673, LV T673, LT T673, LW T673 LH T674 LS T676, LA T676, LO T676, LY T676, LB T676, LH T676, LSB T676, LW T676 LB T67C, LV T67C, LT T67C, LS T67K, LO T67K, LY T67K, LW E67C LS E67B, LA E67B, LO E67B, LY E67B, LB E67C, LV E67C, LT E67C LW T67C LS T679, LY T679, LG T679 LS T770, LO T770, LY T770, LG T770, LP T770 LB T773, LV T773, LT T773, LW T773 LH T774 LS E675, LA E675, LY E675, LS T675 LS T776, LA T776, LO T776, LY T776, LB T776 LHGB T686 LT T68C, LB T68C - Hyper Mini TOPLED® LB M676 - Mini TOPLED Santana® LG M470 LS M47K, LO M47K, LY M47K Source: http://www.osram.convergy.de/; OC_NEWARK: unknown
LED2 = adafruit:RGBLED: For 5050 RGB LEDs, the order of the LEDs may vary from one manufacturer to another!; OC_NEWARK: unknown
LED8 LED9 = adafruit:LED: LED OSRAM: - CHIPLED LG R971, LG N971, LY N971, LG Q971, LY Q971, LO R971, LY R971 LH N974, LH R974 LS Q976, LO Q976, LY Q976 LO Q996 - Hyper CHIPLED LW Q18S LB Q993, LB Q99A, LB R99A - SideLED LS A670, LO A670, LY A670, LG A670, LP A670 LB A673, LV A673, LT A673, LW A673 LH A674 LY A675 LS A676, LA A676, LO A676, LY A676, LW A676 LS A679, LY A679, LG A679 - Hyper Micro SIDELED® LS Y876, LA Y876, LO Y876, LY Y876 LT Y87S - SmartLED LW L88C, LW L88S LB L89C, LB L89S, LG L890 LS L89K, LO L89K, LY L89K LS L896, LA L896, LO L896, LY L896 - TOPLED LS T670, LO T670, LY T670, LG T670, LP T670 LSG T670, LSP T670, LSY T670, LOP T670, LYG T670 LG T671, LOG T671, LSG T671 LB T673, LV T673, LT T673, LW T673 LH T674 LS T676, LA T676, LO T676, LY T676, LB T676, LH T676, LSB T676, LW T676 LB T67C, LV T67C, LT T67C, LS T67K, LO T67K, LY T67K, LW E67C LS E67B, LA E67B, LO E67B, LY E67B, LB E67C, LV E67C, LT E67C LW T67C LS T679, LY T679, LG T679 LS T770, LO T770, LY T770, LG T770, LP T770 LB T773, LV T773, LT T773, LW T773 LH T774 LS E675, LA E675, LY E675, LS T675 LS T776, LA T776, LO T776, LY T776, LB T776 LHGB T686 LT T68C, LB T68C - Hyper Mini TOPLED® LB M676 - Mini TOPLED Santana® LG M470 LS M47K, LO M47K, LY M47K Source: http://www.osram.convergy.de/
LIPO_FB = SparkFun:M04: Header 4 Standard 4-pin 0.1" header. Use with straight break away headers (SKU : PRT-00116), right angle break away headers (PRT-00553), swiss pins (PRT-00743), machine pins (PRT-00117), and female headers (PRT-00115). Molex polarized connector foot print use with SKU : PRT-08231 with associated crimp pins and housings.; OC_NEWARK: unknown
LIPO_INPUT = con-dinkle:ST02: Dinkle® Screw Terminal Block - 2 Way -5MM: EK500V series. Rated at 20A, 300VAC. Cable size: 2mm² Supplier: Altronics P2034A Source: http://www.dinkle.com/upfiles/proter21253708953.pdf -5.08MM: The back half of a EK500V4R-04P. Rated at 20A, 300VAC. Cable size: 2mm² Supplier: Altronics P2024 (half of) Source: http://www.dinkle.com/upfiles/proter21253708833.pdf -3.5MM: ED350V series. Rated at 10A, 300VAC. Cable size: 1.4mm² Supplier: Altronics P2028 Source: http://www.dinkle.com/upfiles/proter21253714491.pdf; OC_NEWARK: unknown
MAIN_PWR_SW RST_ACTUATOR1 RST_FTDI_TIVA1 RX TX = SparkFun:M02: Header 2 Standard 2-pin 0.1" header. Use with straight break away headers (SKU : PRT-00116), right angle break away headers (PRT-00553), swiss pins (PRT-00743), machine pins (PRT-00117), and female headers (PRT-00115). Molex polarized connector foot print use with SKU : PRT-08233 with associated crimp pins and housings.; OC_NEWARK: unknown
PTCFUSE1 = pinhead:PINHD-1X2: PIN HEADER; OC_NEWARK: unknown
Q1 Q5 = SparkFun-DiscreteSemi:MOSFET-NCHANNEL: Common NMOSFET Parts MFG P/N Store ID Prod ID FDD8780 TRANS-09984 SI7820DN TRANS-11055 FDS6630A IC-08089 2N7002PW TRANS-11151 FQP30N06L COM-10213 TRANS-10060 BSS123LT1G TRANS-08345 BSS138 TRANS-00830 BS170 2N7000; OC_NEWARK: unknown; PROD_ID: TRANS-00830
Q2 = semicon-smd-ipc:NPN-TRANSISTOR_: NPN TRANSISTOR
R1-R7 R9-R14 R17 R21-R27 R29-R33 R35-R48 = resistor:R-US_: RESISTOR, American symbol; OC_NEWARK: unknown
R15 R16 R28 = resistor:R-US_: RESISTOR, American symbol
U1-U7 = ti_tpd2e2u06:TPD2E2U06: LOW-CAPACITANCE 2-CHANNEL ±15-kV ESD-PROTECTION ARRAY; MPN: TPD2E001IDRLRQ1; OC_FARNELL: -; OC_NEWARK: 55R7553; PACKAGE: SOT-23-5; SUPPLIER: Texas Instruments
U$1 = tiva:TIVA; OC_NEWARK: unknown
U$4 = PTN78000W:PTN78000W
V8ZA2P-1-V8ZA2P-4 = SparkFun-DiscreteSemi:V18ZA2P: Varistor; OC_NEWARK: unknown
XB1 = maxstream:XBEE: XBee (TM) /XBee-PRO(TM) OEM RF Modules Source: MaxStream, Inc. xbee_productmanual.pdf; MPN: XBP24-Z7UIT-004; OC_FARNELL: 1751799; OC_NEWARK: 34R5507

## Net classes
0 default: width 0.35 mm